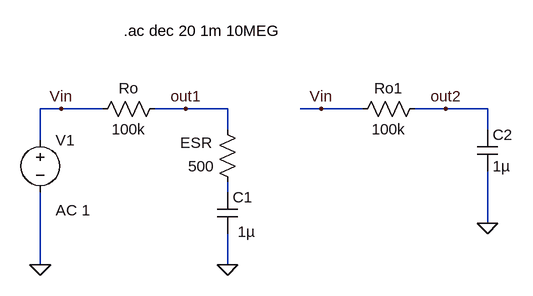
[diagram p0: schematic RC_Filter.asc]
RC_Filter.asc, the LTspice schematic file:
Version 4
SHEET 1 948 680
WIRE -64 96 -96 96
WIRE 0 96 -64 96
WIRE 128 96 80 96
WIRE 192 96 128 96
WIRE 336 96 304 96
WIRE 400 96 336 96
WIRE 528 96 480 96
WIRE 592 96 528 96
WIRE 192 128 192 96
WIRE 592 128 592 96
WIRE -96 144 -96 96
WIRE 192 224 192 208
WIRE 592 272 592 192
WIRE -96 336 -96 224
WIRE 192 336 192 288
FLAG -96 336 0
FLAG 192 336 0
FLAG 128 96 out1
FLAG -64 96 Vin
FLAG 528 96 out2
FLAG 592 272 0
FLAG 336 96 Vin
SYMBOL res 96 80 R90
WINDOW 0 0 56 VBottom 2
WINDOW 3 32 56 VTop 2
SYMATTR InstName Ro
SYMATTR Value 100k
SYMBOL res 208 224 R180
WINDOW 0 40 76 Left 2
WINDOW 3 36 40 Left 2
SYMATTR InstName ESR
SYMATTR Value 500
SYMBOL cap 176 224 R0
WINDOW 3 32 61 Left 2
SYMATTR InstName C1
SYMATTR Value 1µ
SYMBOL voltage -96 128 R0
WINDOW 123 24 124 Left 2
WINDOW 39 0 0 Left 2
SYMATTR Value2 AC 1
SYMATTR InstName V1
SYMATTR Value ""
SYMBOL res 496 80 R90
WINDOW 0 0 56 VBottom 2
WINDOW 3 32 56 VTop 2
SYMATTR InstName Ro1
SYMATTR Value 100k
SYMBOL cap 576 128 R0
SYMATTR InstName C2
SYMATTR Value 1µ
TEXT 32 -24 Left 2 !.ac dec 20 1m 10MEG

The netlist it stands for:
* RC_Filter.asc
Ro out1 Vin 100k
R§ESR N001 out1 500
C1 N001 0 1µ
V1 Vin 0 AC 1
Ro1 out2 Vin 100k
C2 out2 0 1µ
.ac dec 20 1m 10MEG
.backanno
.end

* Results of the author's LTspice run, read from the files saved beside the schematic
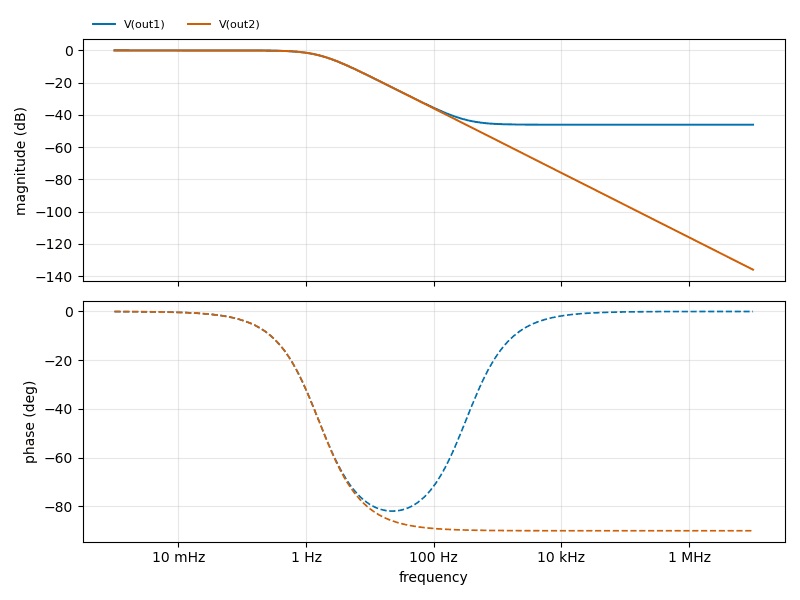
[diagram p1: AC Analysis of RC_Filter.asc, plotted from the saved traces]
* AC Analysis, 1 run:
*   V(out1): -0.00 dB at 1 mHz, -46.06 dB at 10 MHz, peak -0.00 dB at 1 mHz, 3 dB below the peak at 1.584 Hz
*   V(out2): -0.00 dB at 1 mHz, -135.96 dB at 10 MHz, peak -0.00 dB at 1 mHz, 3 dB below the peak at 1.591 Hz